# Altium project SuperCapV3Control.PrjPCB
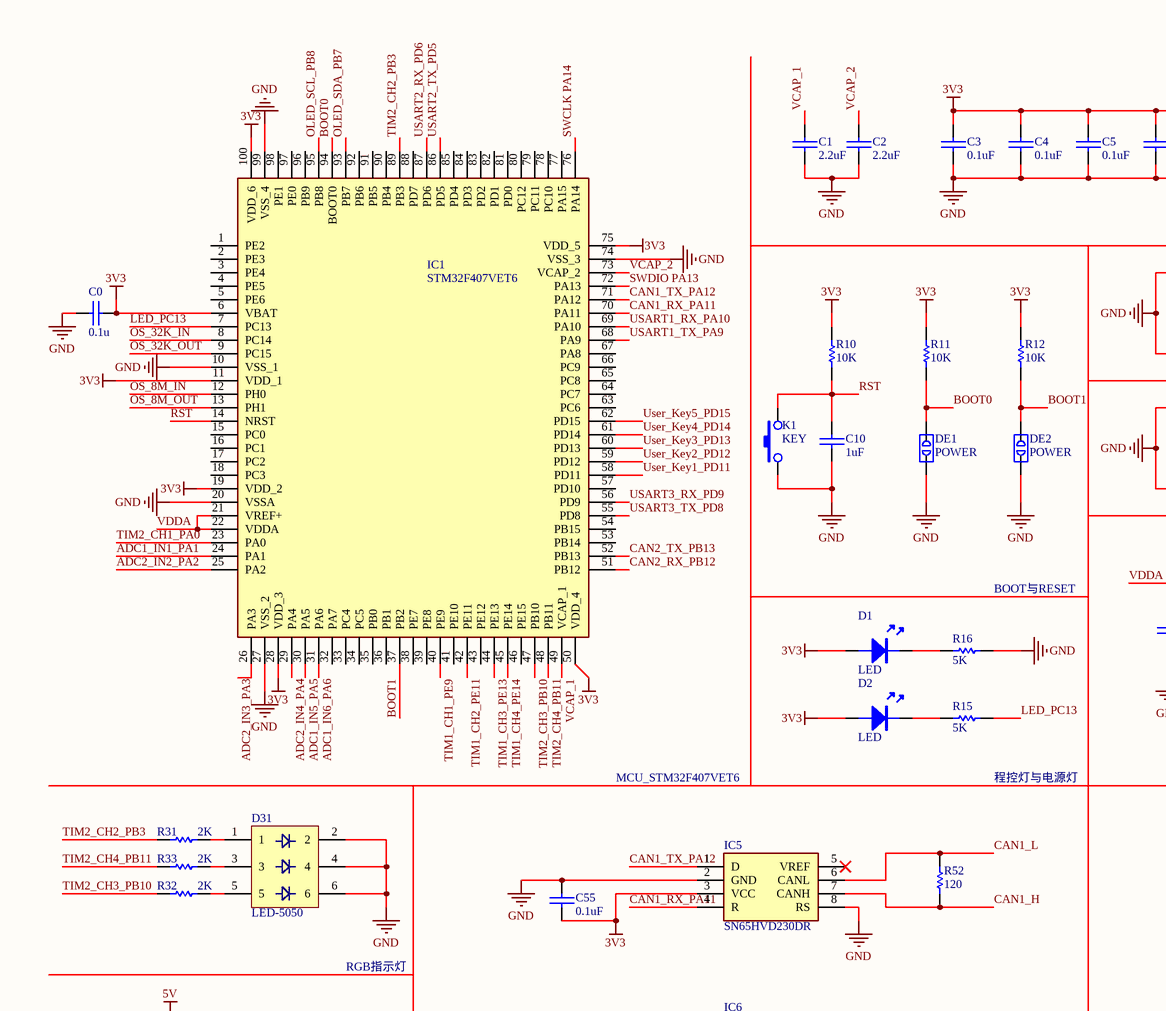
[diagram p0: SuperCapV3Control.SchDoc, top left]
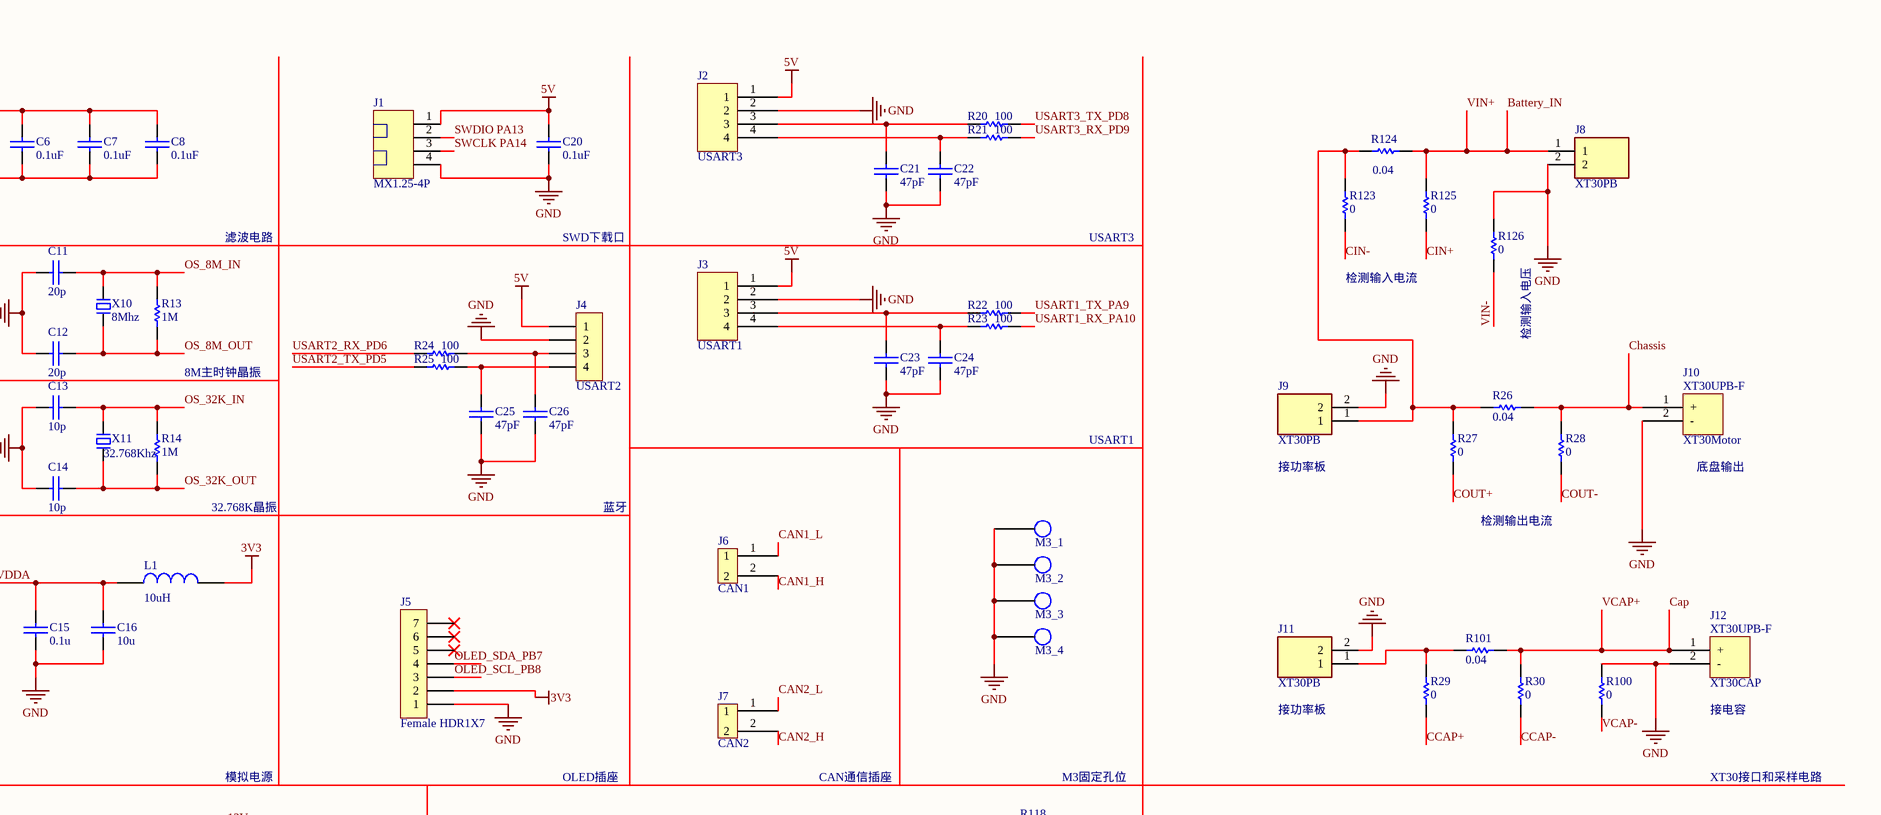
[diagram p1: SuperCapV3Control.SchDoc, top right]
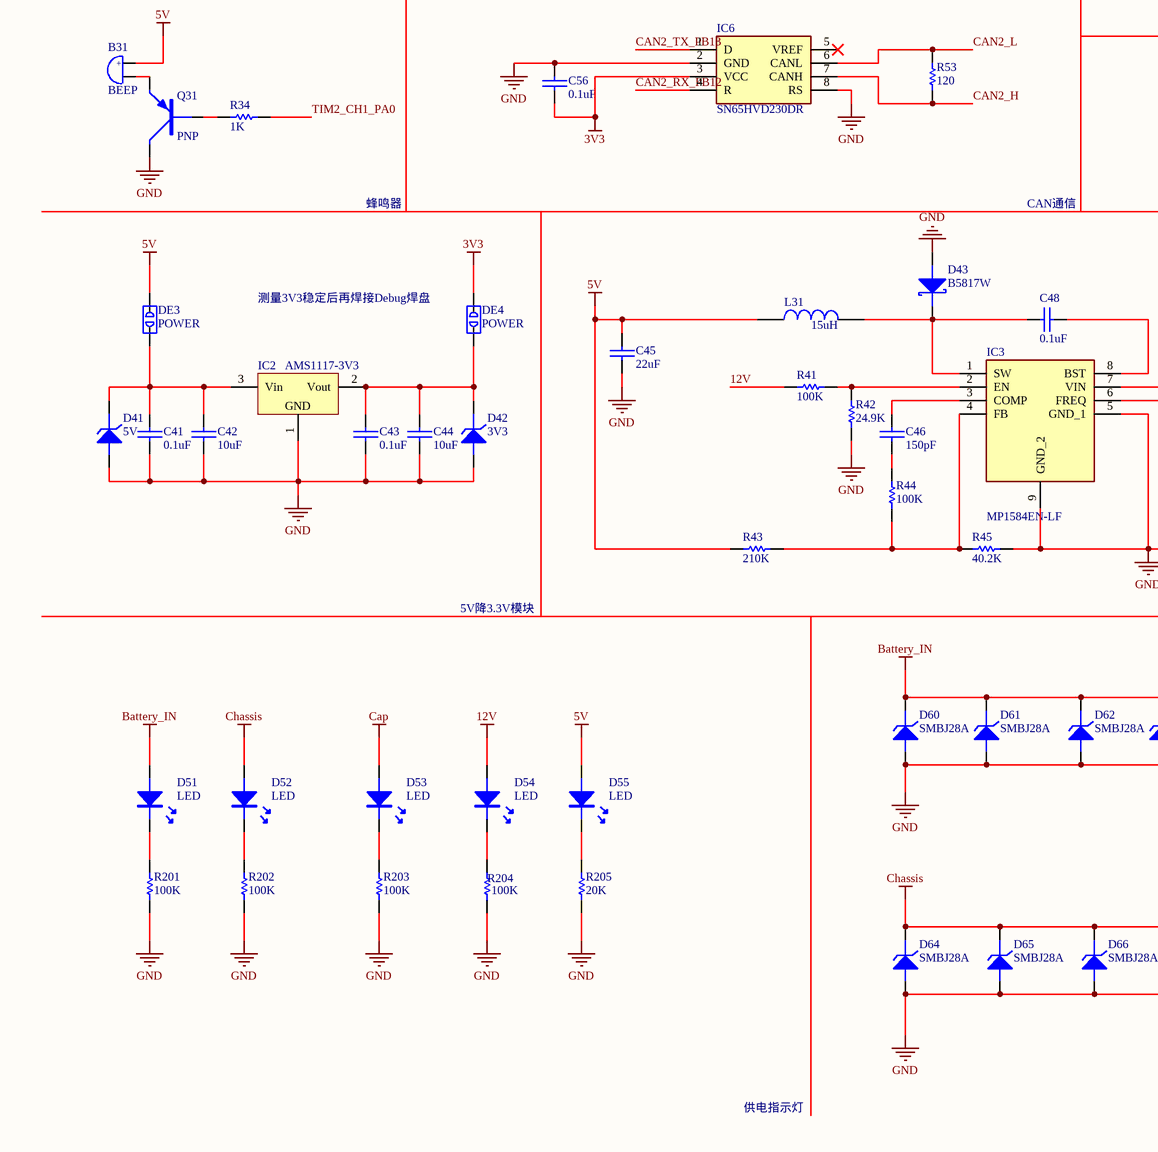
[diagram p2: SuperCapV3Control.SchDoc, bottom left]
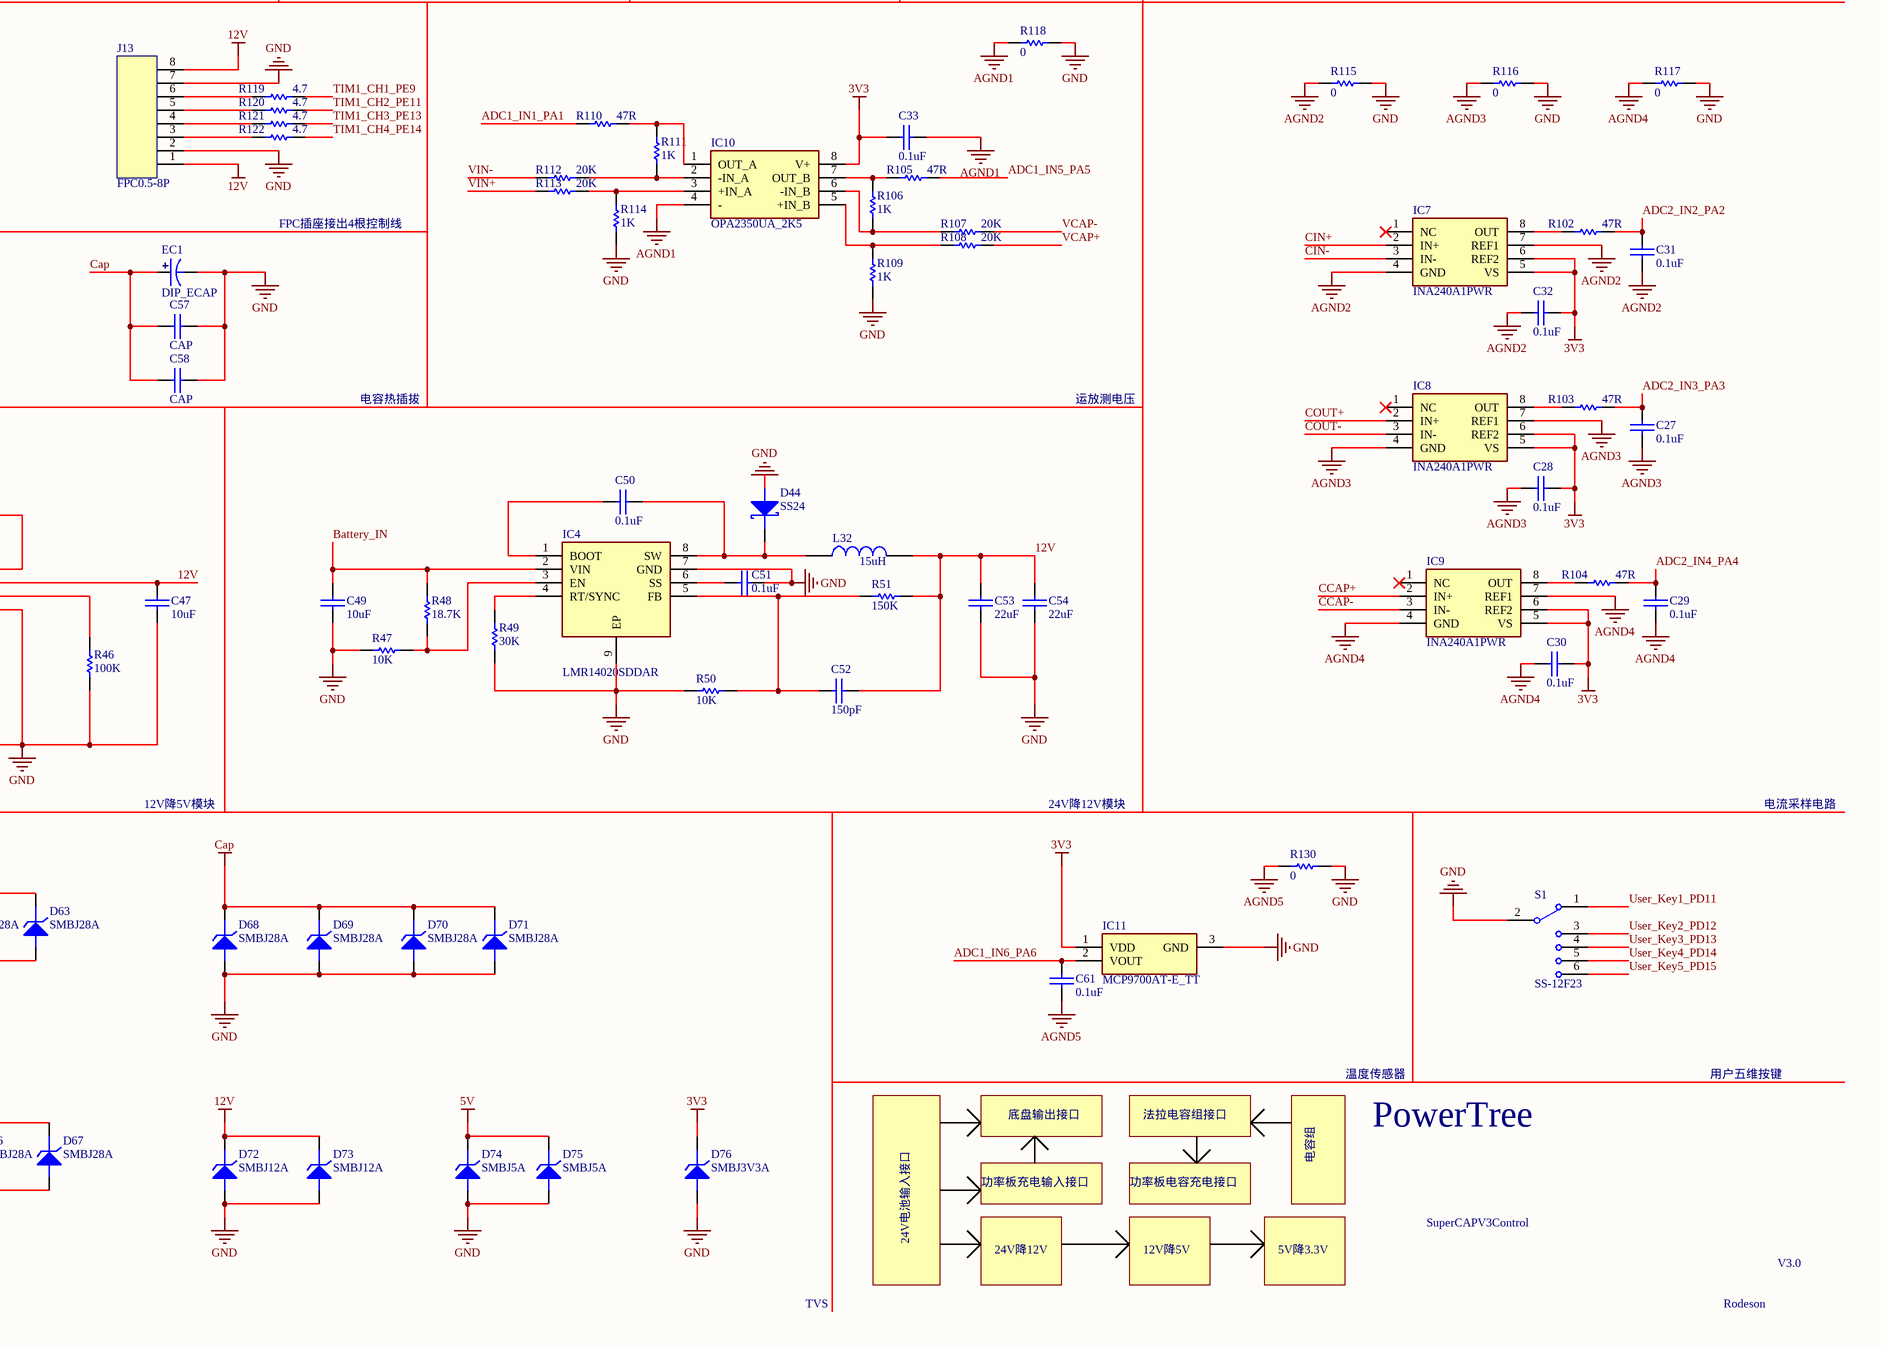
[diagram p3: SuperCapV3Control.SchDoc, bottom right]
1 sheet, 188 parts. Net scope: global (net labels, ports and power ports of the same name join across sheets).
Board file: SuperCapV3Control.PcbDoc

## Sheet SuperCapV3Control.SchDoc
size A2

### Parts
B31  BEEP  [BEEP 6.5x12x8.5]
C0  0.1u  [0603C]
C1  2.2uF  [0603C]
C2  2.2uF  [0603C]
C3  0.1uF  [0603C]
C4  0.1uF  [0603C]
C5  0.1uF  [0603C]
C6  0.1uF  [0603C]
C7  0.1uF  [0603C]
C8  0.1uF  [0603C]
C10  1uF  [0603C]
C11  20p  [0603C]
C12  20p  [0603C]
C13  10p  [0603C]
C14  10p  [0603C]
C15  0.1u  [0603C]
C16  10u  [0603C]
C20  0.1uF  [0603C]
C21  47pF  [0603C]
C22  47pF  [0603C]
C23  47pF  [0603C]
C24  47pF  [0603C]
C25  47pF  [0603C]
C26  47pF  [0603C]
C27  0.1uF  [0603C]
C28  0.1uF  [0603C]
C29  0.1uF  [0603C]
C30  0.1uF  [0603C]
C31  0.1uF  [0603C]
C32  0.1uF  [0603C]
C33  0.1uF  [0603C]
C41  0.1uF  [0805C]
C42  10uF  [0805C]
C43  0.1uF  [0805C]
C44  10uF  [0805C]
C45  22uF  [1206C]
C46  150pF  [0603C]
C47  10uF  [1206C]
C48  0.1uF  [0603C]
C49  10uF  [1206C]
C50  0.1uF  [0603C]
C51  0.1uF  [0603C]
C52  150pF  [0603C]
C53  22uF  [1206C]
C54  22uF  [1206C]
C55  0.1uF  [0603C]
C56  0.1uF  [0603C]
C57  CAP  [1812C]
C58  CAP  [1812C]
C61  0.1uF  [0603C]
D1  LED  [LED-0603G]
D2  LED  [LED-0603G]
D31  LED-5050  [LED-5050W]
D41  5V  [SMC/DO-214AB]
D42  3V3  [SMC/DO-214AB]
D43  B5817W  [SMA/DO-214AC]
D44  SS24  [SMA/DO-214AC]
D51  LED  [LED-0603G]
D52  LED  [LED-0603G]
D53  LED  [LED-0603G]
D54  LED  [LED-0603G]
D55  LED  [LED-0603G]
D60  SMBJ28A  [SMB/DO-214AA]
D61  SMBJ28A  [SMB/DO-214AA]
D62  SMBJ28A  [SMB/DO-214AA]
D63  SMBJ28A  [SMB/DO-214AA]
D64  SMBJ28A  [SMB/DO-214AA]
D65  SMBJ28A  [SMB/DO-214AA]
D66  SMBJ28A  [SMB/DO-214AA]
D67  SMBJ28A  [SMB/DO-214AA]
D68  SMBJ28A  [SMB/DO-214AA]
D69  SMBJ28A  [SMB/DO-214AA]
D70  SMBJ28A  [SMB/DO-214AA]
D71  SMBJ28A  [SMB/DO-214AA]
D72  SMBJ12A  [SMB/DO-214AA]
D73  SMBJ12A  [SMB/DO-214AA]
D74  SMBJ5A  [SMB/DO-214AA]
D75  SMBJ5A  [SMB/DO-214AA]
D76  SMBJ3V3A  [SMB/DO-214AA]
DE1  POWER  [DEBUG_A]
DE2  POWER  [DEBUG_A]
DE3  POWER  [DEBUG_A]
DE4  POWER  [DEBUG_A]
EC1  DIP_ECAP  [DIP-EC5.0X10X20-A]
IC1  STM32F407VET6  [QFP50P1600X1600X160-100N]
IC2  AMS1117-3V3  [SOT-223]
IC3  MP1584EN-LF  [SOIC127P600X170-9N]
IC4  LMR14020SDDAR  [SOIC127P600X170-9N]
IC5  SN65HVD230DR  [SOT127P600X175-8N]
IC6  SN65HVD230DR  [SOT127P600X175-8N]
IC7  INA240A1PWR  [SOP65P640X120-8N]
IC8  INA240A1PWR  [SOP65P640X120-8N]
IC9  INA240A1PWR  [SOP65P640X120-8N]
IC10  OPA2350UA_2K5  [SOIC127P600X175-8N]
IC11  MCP9700AT-E_TT  [SOT23]
J1  MX1.25-4P  [MX1.25WS-4P]
J2  USART3  [GH1.25_4P]
J3  USART1  [GH1.25_4P]
J4  USART2  [Fe-HDR1X4/2.54-S]
J5  Female HDR1X7  [Fe-HDR1X7/2.54-S]
J6  CAN1  [GH1.25_2P]
J7  CAN2  [GH1.25_2P]
J8  XT30PB  [XT30PB]
J9  XT30PB  [XT30PB]
J10  XT30Motor  [XT30UPB-F]
J11  XT30PB  [XT30PB]
J12  XT30CAP  [XT30UPB-F]
J13  FPC0.5-8P  [FPC0.5-8P]
K1  KEY  [SMD-3X6X2.5]
L1  10uH  [0603L]
L31  15uH  [0630L]
L32  15uH  [0630L]
M3_1  Hole  [M3]  (value not drawn)
M3_2  Hole  [M3]  (value not drawn)
M3_3  Hole  [M3]  (value not drawn)
M3_4  Hole  [M3]  (value not drawn)
Q31  PNP  [SOT-23]
R10  10K  [0603R]
R11  10K  [0603R]
R12  10K  [0603R]
R13  1M  [0805R]
R14  1M  [0805R]
R15  5K  [0603R]
R16  5K  [0603R]
R20  100  [0603R]
R21  100  [0603R]
R22  100  [0603R]
R23  100  [0603R]
R24  100  [0603R]
R25  100  [0603R]
R26  0.04  [2512R]
R27  0  [0603R]
R28  0  [0603R]
R29  0  [0603R]
R30  0  [0603R]
R31  2K  [0603R]
R32  2K  [0603R]
R33  2K  [0603R]
R34  1K  [0603R]
R41  100K  [0603R]
R42  24.9K  [0603R]
R43  210K  [0603R]
R44  100K  [0603R]
R45  40.2K  [0603R]
R46  100K  [0603R]
R47  10K  [0603R]
R48  18.7K  [0603R]
R49  30K  [0603R]
R50  10K  [0603R]
R51  150K  [0603R]
R52  120  [0603R]
R53  120  [0603R]
R100  0  [0603R]
R101  0.04  [2512R]
R102  47R  [0805R]
R103  47R  [0805R]
R104  47R  [0805R]
R105  47R  [0603R]
R106  1K  [0603R]
R107  20K  [0603R]
R108  20K  [0603R]
R109  1K  [0603R]
R110  47R  [0603R]
R111  1K  [0603R]
R112  20K  [0603R]
R113  20K  [0603R]
R114  1K  [0603R]
R115  0  [0603R]
R116  0  [0603R]
R117  0  [0603R]
R118  0  [0603R]
R119  4.7  [0603R]
R120  4.7  [0603R]
R121  4.7  [0603R]
R122  4.7  [0603R]
R123  0  [0603R]
R124  0.04  [2512R]
R125  0  [0603R]
R126  0  [0603R]
R130  0  [0603R]
R201  100K  [0603R]
R202  100K  [0603R]
R203  100K  [0603R]
R204  100K  [0603R]
R205  20K  [0603R]
S1  SS-12F23  [五向开关]
X10  8Mhz  [OSC HC-49S]
X11  32.768Khz  [OSC HC-49S]

### Nets
3V3: C0.1 C3.2 C4.2 C5.2 C6.2 C7.2 C8.2 C28.2 C30.2 C32.2 C33.1 C55.1 C56.1 D1.A D2.A D76.K DE4.1 IC1.6(VBAT) IC1.11(VDD_1) IC1.19(VDD_2) IC1.28(VDD_3) IC1.50(VDD_4) IC1.75(VDD_5) IC1.100(VDD_6) IC5.3(VCC) IC6.3(VCC) IC7.5(VS) IC7.6(REF2) IC8.5(VS) IC8.6(REF2) IC9.5(VS) IC9.6(REF2) IC10.8(V+) IC11.1(VDD) J5.2 L1.2 R10.2 R11.2 R12.2
5V: B31.1 C20.2 C45.2 D55.A D74.K D75.K DE3.1 J1.1 J2.1 J3.1 J4.1 L31.1 R43.1
12V: C47.2 C52.2 C53.2 C54.2 D54.A D72.K D73.K IC3.7(VIN) J13.1 J13.8 L32.2 R41.1 R51.2
AGND1: C33.2 IC10.4(-) R118.2
AGND2: C31.2 C32.1 IC7.4(GND) IC7.7(REF1) R115.2
AGND3: C27.2 C28.1 IC8.4(GND) IC8.7(REF1) R116.2
AGND4: C29.2 C30.1 IC9.4(GND) IC9.7(REF1) R117.2
AGND5: C61.1 R130.2
Battery_IN: C49.2 D51.A D60.K D61.K D62.K D63.K IC4.2(VIN) J8.1 R48.1 R113.1 R124.2 R125.2  [also labelled VIN+]
Cap: C57.1 C58.1 D53.A D68.K D69.K D70.K D71.K EC1.1 J12.1(+) R30.2 R101.2 R108.2  [also labelled VCAP+]
Chassis: D52.A D64.K D65.K D66.K D67.K J10.1(+) R26.2 R28.2
GND: C0.2 C1.1 C2.1 C3.1 C4.1 C5.1 C6.1 C7.1 C8.1 C10.1 C11.1 C12.1 C13.1 C14.1 C15.1 C16.1 C20.1 C21.1 C22.1 C23.1 C24.1 C25.1 C26.1 C41.1 C42.1 C43.1 C44.1 C45.1 C47.1 C49.1 C51.2 C53.1 C54.1 C55.2 C56.2 C57.2 C58.2 D31.2 D31.4 D31.6 D41.A D42.A D43.A D44.A D60.A D61.A D62.A D63.A D64.A D65.A D66.A D67.A D68.A D69.A D70.A D71.A D72.A D73.A D74.A D75.A D76.A DE1.1 DE2.1 EC1.2 IC1.10(VSS_1) IC1.20(VSSA) IC1.27(VSS_2) IC1.74(VSS_3) IC1.99(VSS_4) IC2.1(GND) IC3.5(GND_1) IC3.9(GND_2) IC4.7(GND) IC4.9(EP) IC5.2(GND) IC5.8(RS) IC6.2(GND) IC6.8(RS) IC11.3(GND) J1.4 J2.2 J3.2 J4.2 J5.1 J8.2 J9.2 J10.2(-) J11.2 J12.2(-) J13.2 J13.7 K1.1 M3_1.1 M3_2.1 M3_3.1 M3_4.1 Q31.C R16.2 R42.1 R45.2 R46.1 R47.1 R49.1 R50.1 R100.2 R109.1 R114.1 R115.1 R116.1 R117.1 R118.1 R126.2 R130.1 R201.1 R202.1 R203.1 R204.1 R205.1 S1.2
ADC1_IN1_PA1: IC1.24(PA1) R110.1
ADC1_IN5_PA5: IC1.30(PA5) R105.2
ADC1_IN6_PA6: C61.2 IC1.31(PA6) IC11.2(VOUT)
ADC2_IN2_PA2: C31.1 IC1.25(PA2) R102.2
ADC2_IN3_PA3: C27.1 IC1.26(PA3) R103.2
ADC2_IN4_PA4: C29.1 IC1.29(PA4) R104.2
BOOT0: DE1.2 IC1.94(BOOT0) R11.1
BOOT1: DE2.2 IC1.37(PB2) R12.1
CAN1_H: IC5.7(CANH) J6.2 R52.1
CAN1_L: IC5.6(CANL) J6.1 R52.2
CAN1_RX_PA11: IC1.70(PA11) IC5.4(R)
CAN1_TX_PA12: IC1.71(PA12) IC5.1(D)
CAN2_H: IC6.7(CANH) J7.2 R53.1
CAN2_L: IC6.6(CANL) J7.1 R53.2
CAN2_RX_PB12: IC1.51(PB12) IC6.4(R)
CAN2_TX_PB13: IC1.52(PB13) IC6.1(D)
CCAP+: IC9.2(IN+) R29.1
CCAP-: IC9.3(IN-) R30.1
CIN+: IC7.2(IN+) R125.1
CIN-: IC7.3(IN-) R123.1
COUT+: IC8.2(IN+) R27.1
COUT-: IC8.3(IN-) R28.1
LED_PC13: IC1.7(PC13) R15.2
OLED_SCL_PB8: IC1.95(PB8) J5.3
OLED_SDA_PB7: IC1.93(PB7) J5.4
OS_8M_IN: C11.2 IC1.12(PH0) R13.2 X10.2
OS_8M_OUT: C12.2 IC1.13(PH1) R13.1 X10.1
OS_32K_IN: C13.2 IC1.8(PC14) R14.2 X11.2
OS_32K_OUT: C14.2 IC1.9(PC15) R14.1 X11.1
RST: C10.2 IC1.14(NRST) K1.3 R10.1
SWCLK PA14: IC1.76(PA14) J1.3
SWDIO PA13: IC1.72(PA13) J1.2
TIM1_CH1_PE9: IC1.40(PE9) R119.2
TIM1_CH2_PE11: IC1.42(PE11) R120.2
TIM1_CH3_PE13: IC1.44(PE13) R121.2
TIM1_CH4_PE14: IC1.45(PE14) R122.2
TIM2_CH1_PA0: IC1.23(PA0) R34.2
TIM2_CH2_PB3: IC1.89(PB3) R31.1
TIM2_CH3_PB10: IC1.47(PB10) R32.1
TIM2_CH4_PB11: IC1.48(PB11) R33.1
USART1_RX_PA10: IC1.69(PA10) R23.2
USART1_TX_PA9: IC1.68(PA9) R22.2
USART2_RX_PD6: IC1.87(PD6) R24.1
USART2_TX_PD5: IC1.86(PD5) R25.1
USART3_RX_PD9: IC1.56(PD9) R21.2
USART3_TX_PD8: IC1.55(PD8) R20.2
User_Key1_PD11: IC1.58(PD11) S1.1
User_Key2_PD12: IC1.59(PD12) S1.3
User_Key3_PD13: IC1.60(PD13) S1.4
User_Key4_PD14: IC1.61(PD14) S1.5
User_Key5_PD15: IC1.62(PD15) S1.6
VCAP-: R100.1 R107.2
VCAP_1: C1.2 IC1.49(VCAP_1)
VCAP_2: C2.2 IC1.73(VCAP_2)
VDDA: C15.2 C16.2 IC1.21(VREF+) IC1.22(VDDA) L1.1
VIN-: R112.1 R126.1
NetB31_2: B31.2 Q31.E
NetC21_2: C21.2 J2.3 R20.1
NetC22_2: C22.2 J2.4 R21.1
NetC23_2: C23.2 J3.3 R22.1
NetC24_2: C24.2 J3.4 R23.1
NetC25_2: C25.2 J4.4 R25.2
NetC26_2: C26.2 J4.3 R24.2
NetC41_2: C41.2 C42.2 D41.K DE3.2 IC2.3(Vin)
NetC43_2: C43.2 C44.2 D42.K DE4.2 IC2.2(Vout)
NetC46_1: C46.1 R44.2
NetC46_2: C46.2 IC3.3(COMP)
NetC48_1: C48.1 D43.K IC3.1(SW) L31.2
NetC48_2: C48.2 IC3.8(BST)
NetC50_1: C50.1 IC4.1(BOOT)
NetC50_2: C50.2 D44.K IC4.8(SW) L32.1
NetC51_1: C51.1 IC4.6(SS)
NetC52_1: C52.1 IC4.5(FB) R50.2 R51.1
NetD1_K: D1.K R16.1
NetD2_K: D2.K R15.1
NetD31_1: D31.1 R31.2
NetD31_3: D31.3 R33.2
NetD31_5: D31.5 R32.2
NetD51_K: D51.K R201.2
NetD52_K: D52.K R202.2
NetD53_K: D53.K R203.2
NetD54_K: D54.K R204.2
NetD55_K: D55.K R205.2
NetIC3_2: IC3.2(EN) R41.2 R42.2
NetIC3_4: IC3.4(FB) R43.2 R44.1 R45.1
NetIC3_6: IC3.6(FREQ) R46.2
NetIC4_3: IC4.3(EN) R47.2 R48.2
NetIC4_4: IC4.4(RT/SYNC) R49.2
NetIC7_8: IC7.8(OUT) R102.1
NetIC8_8: IC8.8(OUT) R103.1
NetIC9_8: IC9.8(OUT) R104.1
NetIC10_1: IC10.1(OUT_A) R110.2 R111.2
NetIC10_2: IC10.2(-IN_A) R111.1 R112.2
NetIC10_3: IC10.3(+IN_A) R113.2 R114.2
NetIC10_5: IC10.5(+IN_B) R108.1 R109.2
NetIC10_6: IC10.6(-IN_B) R106.1 R107.1
NetIC10_7: IC10.7(OUT_B) R105.1 R106.2
NetJ9_1: J9.1 R26.1 R27.2 R123.2 R124.1
NetJ11_1: J11.1 R29.2 R101.1
NetJ13_3: J13.3 R122.1
NetJ13_4: J13.4 R121.1
NetJ13_5: J13.5 R120.1
NetJ13_6: J13.6 R119.1
NetQ31_B: Q31.B R34.1

Not connected (* = marked no-connect by the designer): IC1 1(PE2) 2(PE3) 3(PE4) 4(PE5) 5(PE6) 15(PC0) 16(PC1) 17(PC2) 18(PC3) 32(PA7) 33(PC4) 34(PC5) 35(PB0) 36(PB1) 38(PE7) 39(PE8) 41(PE10) 43(PE12) 46(PE15) 53(PB14) 54(PB15) 57(PD10) 63(PC6) 64(PC7) 65(PC8) 66(PC9) 67(PA8) 77(PA15) 78(PC10) 79(PC11) 80(PC12) 81(PD0) 82(PD1) 83(PD2) 84(PD3) 85(PD4) 88(PD7) 90(PB4) 91(PB5) 92(PB6) 96(PB9) 97(PE0) 98(PE1); IC5 5(VREF)*; IC6 5(VREF)*; IC7 1(NC)*; IC8 1(NC)*; IC9 1(NC)*; J5 5* 6* 7*

### Notes on the sheet
- 滤波电路
- SWD下载口
- USART3
- 检测输入电流
- 检测输入电压
- 8M主时钟晶振
- USART1
- (near J9) 接功率板
- (near J10) 底盘输出
- 32.768K晶振
- 蓝牙
- 检测输出电流
- BOOT与RESET
- (near J11) 接功率板
- (near J12) 接电容
- MCU_STM32F407VET6
- 程控灯与电源灯
- 模拟电源
- OLED插座
- CAN通信插座
- (near R118) M3固定孔位
- XT30接口和采样电路
- RGB指示灯
- FPC插座接出4根控制线
- 蜂鸣器
- CAN通信
- 电容热插拔
- 运放测电压
- 测量3V3稳定后再焊接Debug焊盘
- 5V降3.3V模块
- 12V降5V模块
- 24V降12V模块
- 电流采样电路
- 温度传感器
- 用户五维按键
- 底盘输出接口
- 法拉电容组接口
- 电容组
- PowerTree
- 24V电池输入接口
- 功率板充电输入接口
- 功率板电容充电接口
- SuperCAPV3Control
- 供电指示灯
- TVS
- 24V降12V
- 12V降5V
- 5V降3.3V
- Rodeson
- V3.0
- (in symbol BEEP) +

### Library data of the parts
B31 = BEEP: 蜂鸣器
C0-C8 C10-C16 C20-C33 C41-C58 C61 = CAP: 无极性电容
D41 D42 D60-D76 = DIODE ZENER: 稳压二极管
D43 D44 = DIODE SCHOTTKY: 肖特基二极管
DE1-DE4 = DEBUG: 调试断点焊盘; 版权归属: 源创客; BOM名称: 调试断点焊盘; 学习资源: www.ooocke.com
EC1 = DIP_ECAP: 直插电解电容
IC1 = STM32F407VET6: Integrated Circuit; Manufacturer_Name: STMicroelectronics; Datasheet Link: http://www.st.com/web/en/resource/technical/document/datasheet/DM00037051.pdf; Height: 1.6mm; Manufacturer_Part_Number: STM32F407VET6; Mouser Part Number: 511-STM32F407VET6; Mouser Price/Stock: https://www.mouser.co.uk/ProductDetail/STMicroelectronics/STM32F407VET6?qs=Z8%252BeY1k3TIJFAMMqSR%252BGtw%3D%3D; Arrow Part Number: STM32F407VET6; Arrow Price/Stock: https://www.arrow.com/en/products/stm32f407vet6/stmicroelectronics?region=nac
IC2 = AMS1117: 三端稳压芯片; BOM名称: 稳压芯片; 版权归属: 源创客; 学习资源: www.ooocke.com
IC3 = MP1584EN-LF: Integrated Circuit; Manufacturer_Name: Monolithic Power Systems (MPS); Datasheet Link: https://componentsearchengine.com/Datasheets/1/MP1584EN-LF.pdf; Height: 1.7mm; Manufacturer_Part_Number: MP1584EN-LF; Mouser Part Number: 946-MP1584ENLF; Mouser Price/Stock: https://www.mouser.com/Search/Refine.aspx?Keyword=946-MP1584ENLF
IC4 = LMR14020SDDAR: Integrated Circuit; Manufacturer_Name: Texas Instruments; Datasheet Link: http://www.ti.com/lit/gpn/lmr14020; Height: 1.7mm; Manufacturer_Part_Number: LMR14020SDDAR; Mouser Part Number: 595-LMR14020SDDAR; Mouser Price/Stock: https://www.mouser.co.uk/ProductDetail/Texas-Instruments/LMR14020SDDAR?qs=Q2snjRlG%2FBLpJ6bVOizpDA%3D%3D; Arrow Part Number: LMR14020SDDAR; Arrow Price/Stock: https://www.arrow.com/en/products/lmr14020sddar/texas-instruments
IC5 IC6 = SN65HVD230DR: Integrated Circuit; Manufacturer_Name: Texas Instruments; Datasheet Link: http://www.ti.com/lit/gpn/sn65hvd230; Height: 1.75mm; Manufacturer_Part_Number: SN65HVD230DR; Mouser Part Number: 595-SN65HVD230DR; Mouser Price/Stock: https://www.mouser.co.uk/ProductDetail/Texas-Instruments/SN65HVD230DR?qs=QViXGNcIEAtifeQR3pYVUQ%3D%3D; Arrow Part Number: SN65HVD230DR; Arrow Price/Stock: https://www.arrow.com/en/products/sn65hvd230dr/texas-instruments?region=nac
IC7-IC9 = INA240A1PWR: Integrated Circuit; Manufacturer_Name: Texas Instruments; Datasheet Link: http://www.ti.com/lit/gpn/INA240; Height: 1.2mm; Manufacturer_Part_Number: INA240A1PWR; Mouser Part Number: 595-INA240A1PWR; Mouser Price/Stock: https://www.mouser.co.uk/ProductDetail/Texas-Instruments/INA240A1PWR?qs=aVyJF2WnouTDXnRi6tpqfA%3D%3D; Arrow Part Number: INA240A1PWR; Arrow Price/Stock: https://www.arrow.com/en/products/ina240a1pwr/texas-instruments?region=nac
IC10 = OPA2350UA_2K5: Integrated Circuit; Manufacturer_Name: Texas Instruments; Manufacturer_Part_Number: OPA2350UA/2K5; Datasheet Link: http://www.ti.com/lit/gpn/opa2350; Height: 1.75mm; Mouser Part Number: 595-OPA2350UA/2K5; Mouser Price/Stock: https://www.mouser.co.uk/ProductDetail/Texas-Instruments/OPA2350UA-2K5?qs=7nS3%252BbEUL6t75JUF5jEhbw%3D%3D; Arrow Part Number: OPA2350UA/2K5; Arrow Price/Stock: https://www.arrow.com/en/products/opa2350ua2k5/texas-instruments
IC11 = MCP9700AT-E_TT: Integrated Circuit; Manufacturer_Name: Microchip; Manufacturer_Part_Number: MCP9700AT-E/TT; Datasheet Link: http://componentsearchengine.com/Datasheets/1/MCP9700AT-E_TT.pdf; Mouser Part Number: 579-MCP9700AT-E/TT; Mouser Price/Stock: https://www.mouser.co.uk/ProductDetail/Microchip-Technology/MCP9700AT-E-TT?qs=yUQqVecv4quOvELNpOl4bA%3D%3D; Arrow Part Number: MCP9700AT-E/TT; Arrow Price/Stock: https://www.arrow.com/en/products/mcp9700at-ett/microchip-technology?region=nac
J2 J3 = GH1.25_4P
J4 = Female HDR1X4
J6 J7 = GH1.25_2P
J8 J9 J11 = XT30PB: Connector; Manufacturer_Name: Amass; Datasheet Link: https://www.tme.eu/Document/4acc913878197f8c2e30d4b8cdc47230/XT30UPB%20SPEC.pdf; Height: 10.7mm; Manufacturer_Part_Number: XT30PB
J10 J12 = XT30UPB-F
J13 = FPC0.5-8P: 贴片
L1 L31 L32 = INDUCTOR
Q31 = PNP: PNP三极管
R10-R16 R20-R34 R41-R53 R100-R126 R130 R201-R205 = RES
S1 = SSW-1P: 五向开关; BOM名称: 波动开关; 版权归属: 源创客; 学习资源: www.ooocke.com
X10 X11 = XTAL-2P: 2脚无源脚晶振